# EAGLE design RotaryTable_RevB (EAGLE 7.6.0)

## Sheet 1 of 3
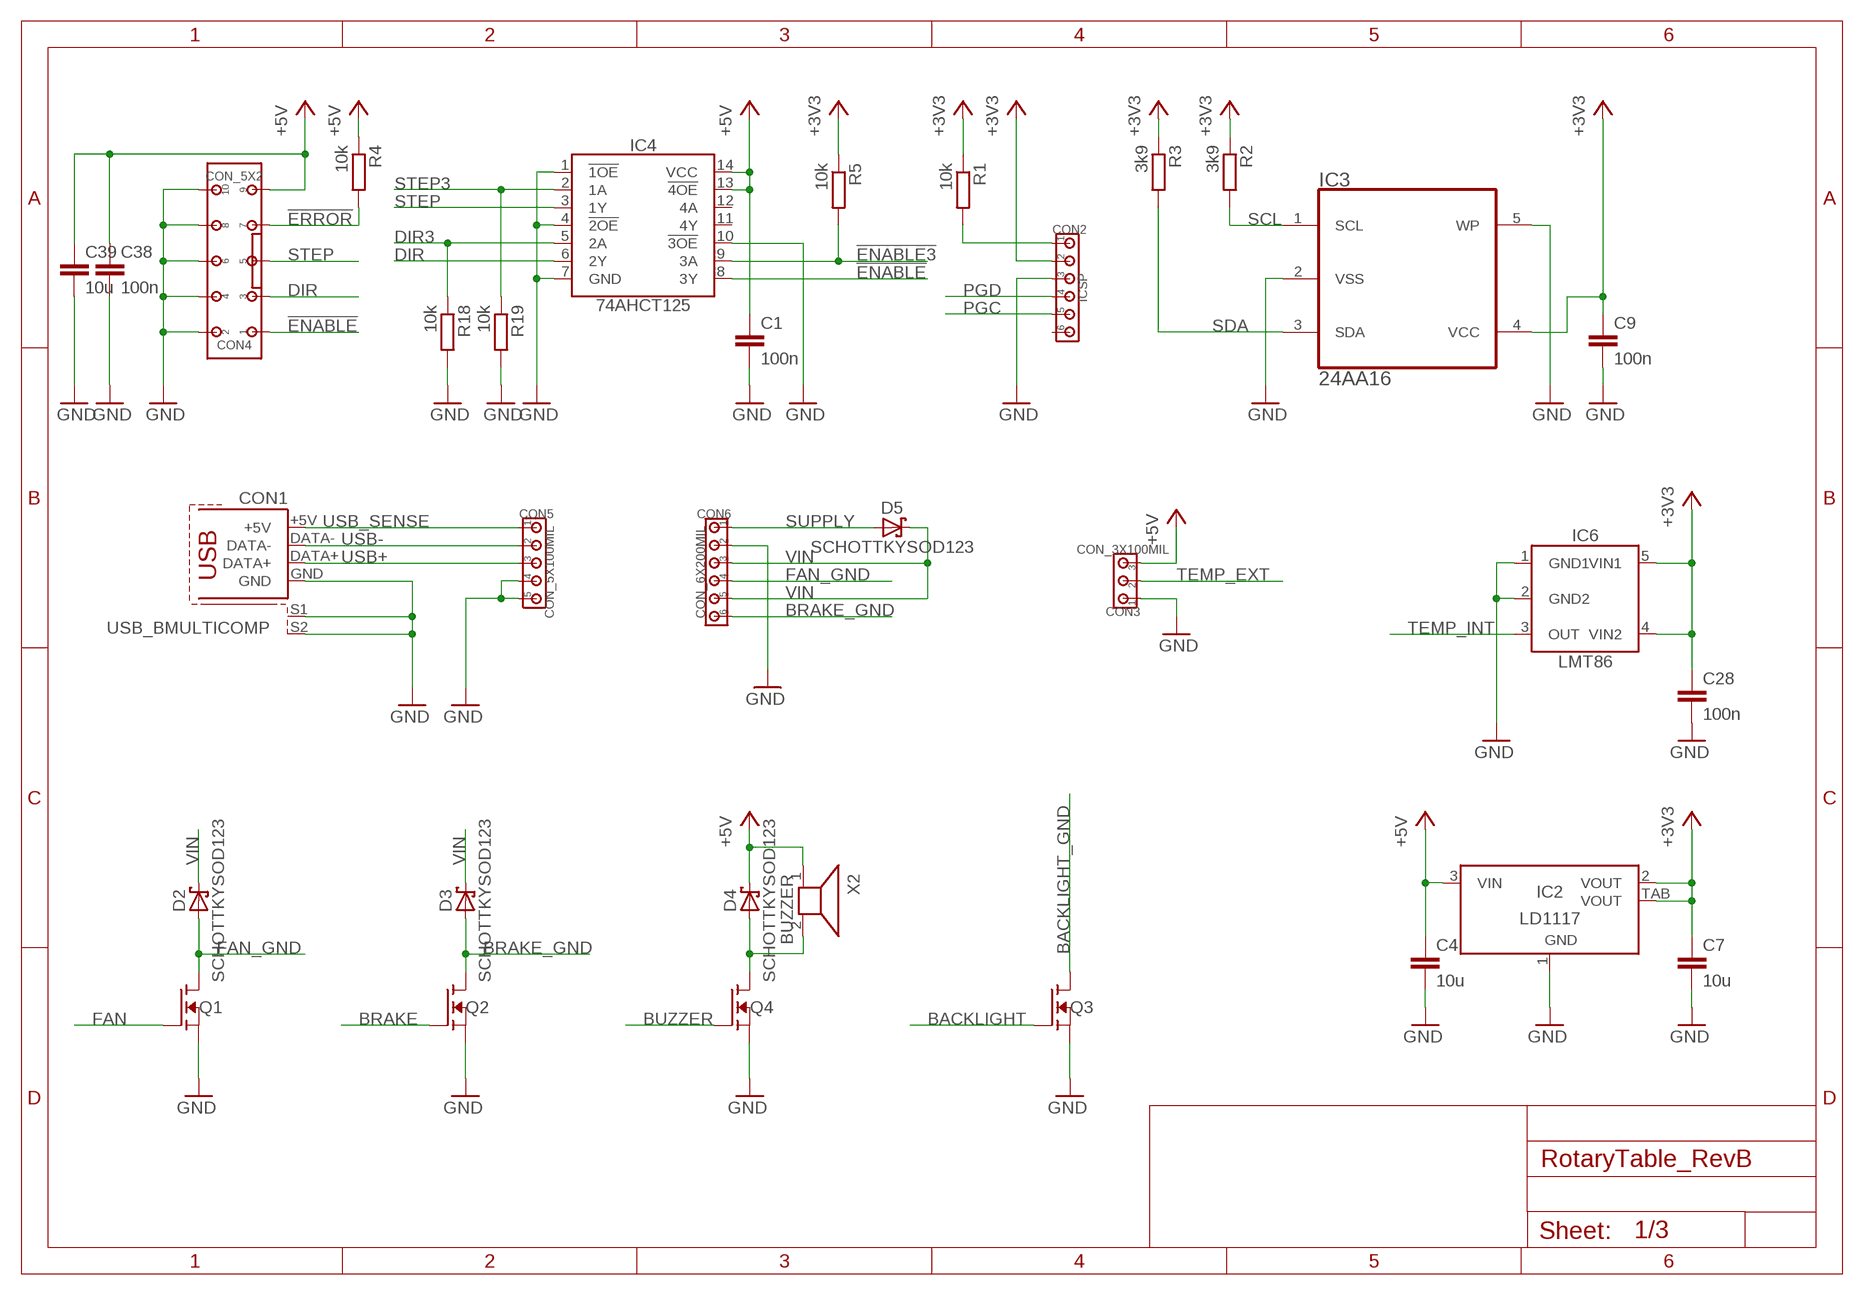
[diagram p0: schematic, sheet 1]

### Parts
C1  100n  CC0805  [C0805]
C4  10u  CC0805  [C0805]
C7  10u  CC0805  [C0805]
C9  100n  CC0805  [C0805]
C28  100n  CC0805  [C0805]
C38  100n  CC0805  [C0805]
C39  10u  CC0805  [C0805]
CON1  USB_BMULTICOMP  [USB_B]
CON2  ICSP  CON_6X100MIL  [100MIL_6X]
CON3  CON_3X100MIL  [100MIL_3X]
CON4  CON_5X2  [100MIL_5X2]
CON5  CON_5X100MIL  [100MIL_5X]
CON6  CON_6X200MIL  [200MIL_6X]
D2  SCHOTTKYSOD123  [SOD123]
D3  SCHOTTKYSOD123  [SOD123]
D4  SCHOTTKYSOD123  [SOD123]
D5  SCHOTTKYSOD123  [SOD123]
IC2  LD1117  [SOT223]
IC3  24AA16  [SOT-23-5]
IC4  74AHCT125  74HC125  [SO14]
IC6  LMT86  [SC70-5]
Q1  N-FETSOT23  [SOT23]
Q2  N-FETSOT23  [SOT23]
Q3  N-FETSOT23  [SOT23]
Q4  N-FETSOT23  [SOT23]
R1  10k  RESISTORR0805  [R0805]
R2  3k9  RESISTORR0805  [R0805]
R3  3k9  RESISTORR0805  [R0805]
R4  10k  RESISTORR0805  [R0805]
R5  10k  RESISTORR0805  [R0805]
R18  10k  RESISTORR0805  [R0805]
R19  10k  RESISTORR0805  [R0805]
X2  BUZZER  [BUZZER_14MM]

### Nets
!ENABLE3!: IC4.9(3A) R5.2 ; also sheet 3
!ENABLE!: CON4.1 IC4.8(3Y)
!ERROR!: CON4.7 R4.2 ; also sheet 3
!MCLR!: CON2.1 R1.2 ; also sheet 3
+3V3: C7.1 C9.1 C28.1 CON2.2 IC2.2(VOUT) IC2.TAB(VOUT) IC3.4(VCC) IC6.4(VIN2) IC6.5(VIN1) R1.1 R2.1 R3.1 R5.1 ; also sheet 2,3
+5V: C1.1 C4.1 C38.1 C39.1 CON3.3 CON4.9 D4.C IC2.3(VIN) IC4.13(!4OE!) IC4.14(VCC) R4.1 X2.1 ; also sheet 2
BACKLIGHT: Q3.1(G) ; also sheet 3
BACKLIGHT_GND: Q3.3(D) ; also sheet 2
BRAKE: Q2.1(G) ; also sheet 3
BRAKE_GND: CON6.6 D3.A Q2.3(D)
BUZZER: Q4.1(G) ; also sheet 3
BUZZER_GND: D4.A Q4.3(D) X2.2
DIR: CON4.3 IC4.6(2Y)
DIR3: IC4.5(2A) R18.1 ; also sheet 3
FAN: Q1.1(G) ; also sheet 3
FAN_GND: CON6.4 D2.A Q1.3(D)
GND: C1.2 C4.2 C7.2 C9.2 C28.2 C38.2 C39.2 CON1.GND CON1.S1 CON1.S2 CON2.3 CON3.1 CON4.2 CON4.4 CON4.6 CON4.8 CON4.10 CON5.4 CON5.5 CON6.2 IC2.1(GND) IC3.2(VSS) IC3.5(WP) IC4.1(!1OE!) IC4.4(!2OE!) IC4.7(GND) IC4.10(!3OE!) IC6.1(GND1) IC6.2(GND2) Q1.2(S) Q2.2(S) Q3.2(S) Q4.2(S) R18.2 R19.2 ; also sheet 2,3
PGC: CON2.5 ; also sheet 3
PGD: CON2.4 ; also sheet 3
SCL: IC3.1(SCL) R2.2 ; also sheet 2,3
SDA: IC3.3(SDA) R3.2 ; also sheet 2,3
STEP: CON4.5 IC4.3(1Y)
STEP3: IC4.2(1A) R19.1 ; also sheet 3
SUPPLY [24V]: CON6.1 D5.A
TEMP_EXT: CON3.2 ; also sheet 3
TEMP_INT: IC6.3(OUT) ; also sheet 3
USB+: CON1.DATA+ CON5.3 ; also sheet 3
USB-: CON1.DATA- CON5.2 ; also sheet 3
USB_SENSE: CON1.+5V CON5.1 ; also sheet 3
VIN [24V]: CON6.3 CON6.5 D2.C D3.C D5.C ; also sheet 2
Unconnected: CON2.6 IC4.11(4Y) IC4.12(4A)

## Sheet 2 of 3
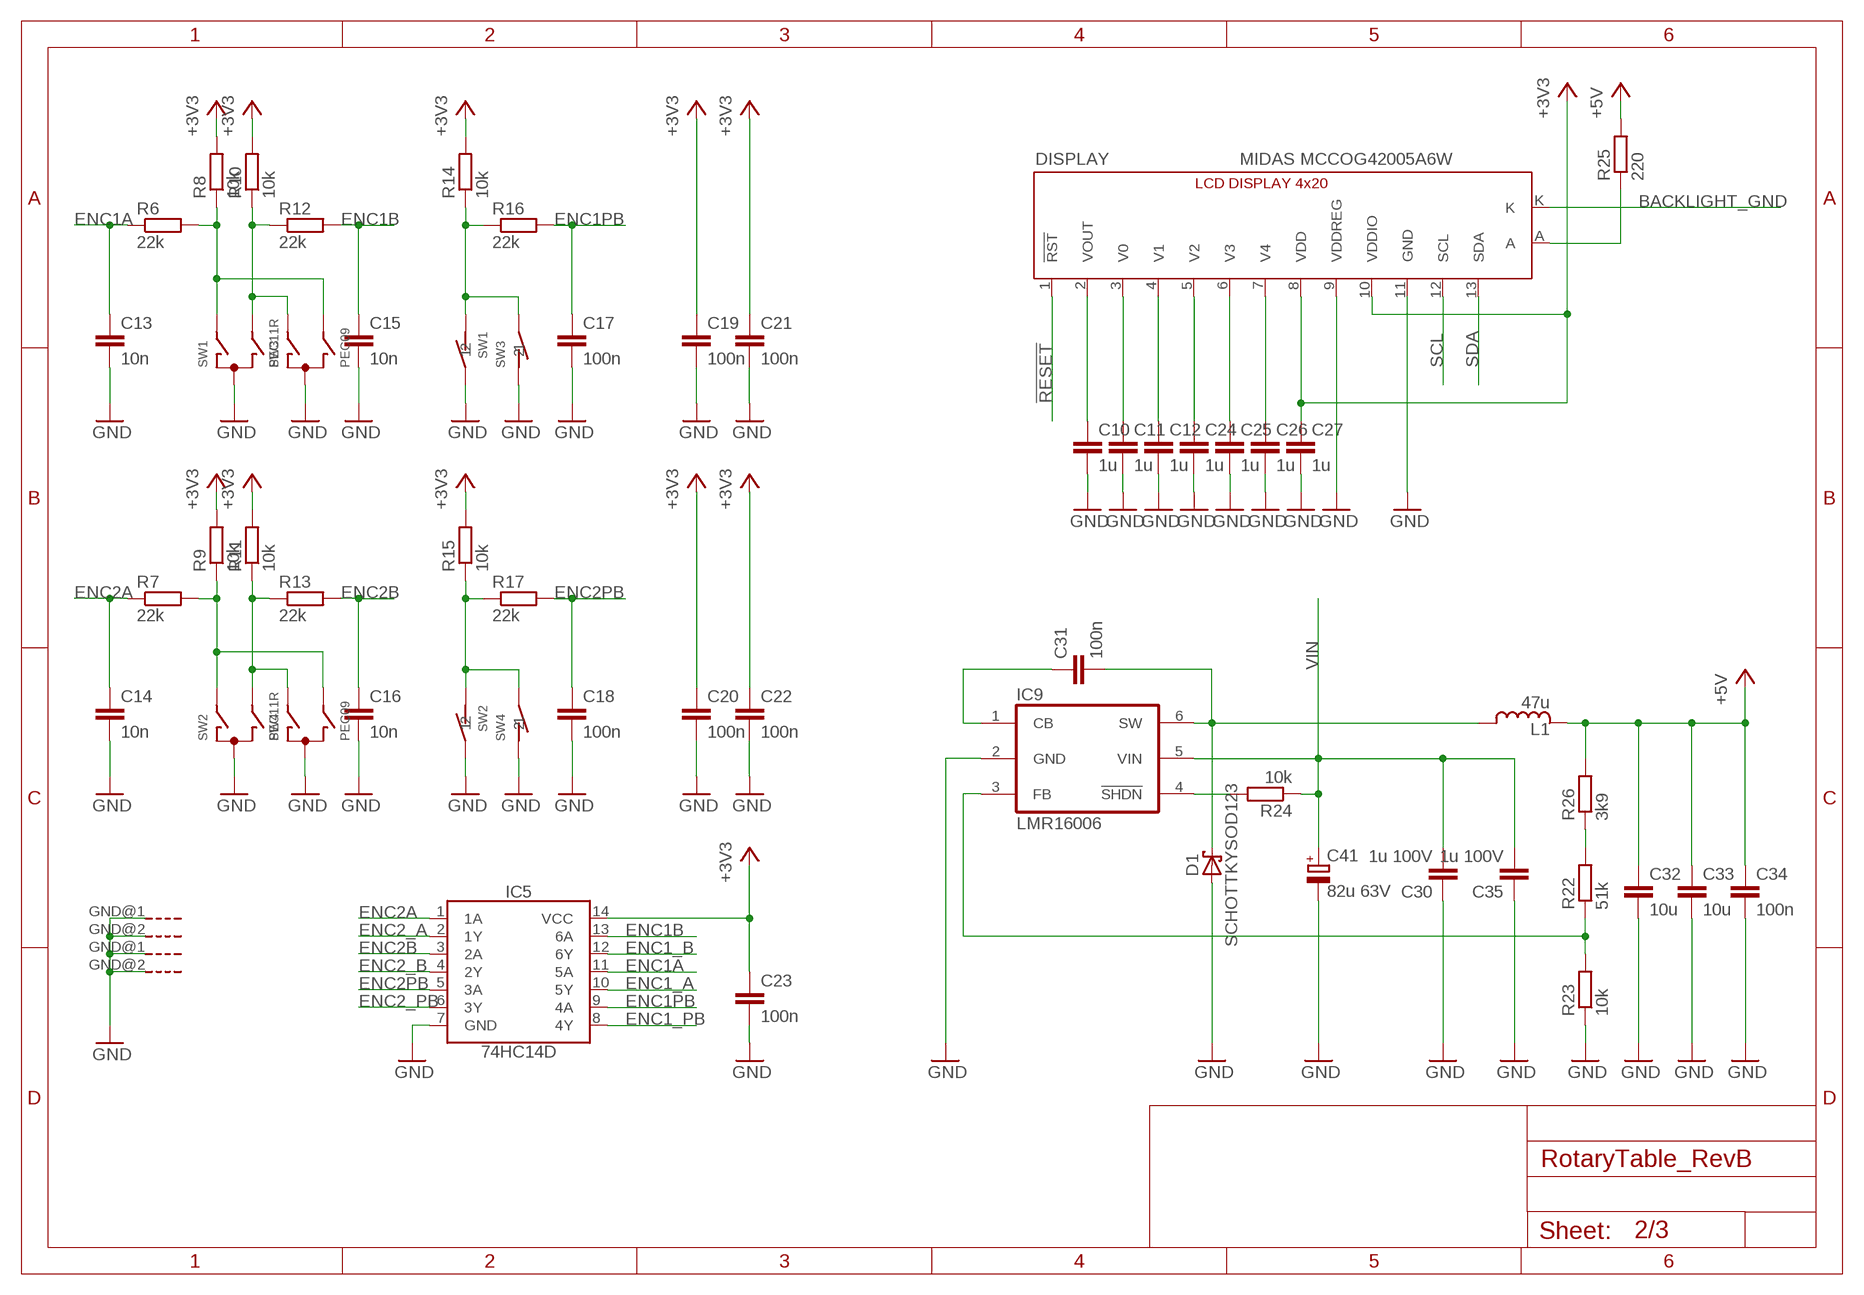
[diagram p1: schematic, sheet 2]

### Parts
C10  1u  CC0805  [C0805]
C11  1u  CC0805  [C0805]
C12  1u  CC0805  [C0805]
C13  10n  CC0805  [C0805]
C14  10n  CC0805  [C0805]
C15  10n  CC0805  [C0805]
C16  10n  CC0805  [C0805]
C17  100n  CC0805  [C0805]
C18  100n  CC0805  [C0805]
C19  100n  CC0805  [C0805]
C20  100n  CC0805  [C0805]
C21  100n  CC0805  [C0805]
C22  100n  CC0805  [C0805]
C23  100n  CC0805  [C0805]
C24  1u  CC0805  [C0805]
C25  1u  CC0805  [C0805]
C26  1u  CC0805  [C0805]
C27  1u  CC0805  [C0805]
C30  1u 100V  CC0805  [C0805]
C31  100n  CC0805  [C0805]
C32  10u  CC0805  [C0805]
C33  10u  CC0805  [C0805]
C34  100n  CC0805  [C0805]
C35  1u 100V  CC0805  [C0805]
C41  82u 63V  C_POLARIZED8MM  [8MM]
D1  SCHOTTKYSOD123  [SOD123]
DISPLAY  MIDAS MCCOG42005A6W  LCD4X20_I2C  [LCD_4X20_I2C]
IC5  74HC14D  [SO14]
IC9  LMR16006  [SOT-32-6]
L1  47u  INDUCTORSRN5040  [SRN5040]
R6  22k  RESISTORR0805  [R0805]
R7  22k  RESISTORR0805  [R0805]
R8  10k  RESISTORR0805  [R0805]
R9  10k  RESISTORR0805  [R0805]
R10  10k  RESISTORR0805  [R0805]
R11  10k  RESISTORR0805  [R0805]
R12  22k  RESISTORR0805  [R0805]
R13  22k  RESISTORR0805  [R0805]
R14  10k  RESISTORR0805  [R0805]
R15  10k  RESISTORR0805  [R0805]
R16  22k  RESISTORR0805  [R0805]
R17  22k  RESISTORR0805  [R0805]
R22  51k  RESISTORR0805  [R0805]
R23  10k  RESISTORR0805  [R0805]
R24  10k  RESISTORR0805  [R0805]
R25  220  RESISTORR0805  [R0805]
R26  3k9  RESISTORR0805  [R0805]
SW1  PEC11R  ENCODER_BOURNS  [ENCODER_BOURNS]
SW2  PEC11R  ENCODER_BOURNS  [ENCODER_BOURNS]
SW3  PEC09  [PEC09]
SW4  PEC09  [PEC09]

### Nets
!RESET!: DISPLAY.1(!RST!) ; also sheet 3
+3V3: C19.1 C20.1 C21.1 C22.1 C23.1 C27.1 DISPLAY.8(VDD) DISPLAY.10(VDDIO) IC5.14(VCC) R8.2 R9.2 R10.2 R11.2 R14.2 R15.2 ; also sheet 1,3
+5V: C32.1 C33.1 C34.1 L1.2 R25.2 R26.2 ; also sheet 1
BACKLIGHT_GND: DISPLAY.K ; also sheet 1
ENC1_A: IC5.10(5Y) ; also sheet 3
ENC1_B: IC5.12(6Y) ; also sheet 3
ENC1_PB: IC5.8(4Y) ; also sheet 3
ENC1A: C13.1 IC5.11(5A) R6.1
ENC1B: C15.1 IC5.13(6A) R12.2
ENC1PB: C17.1 IC5.9(4A) R16.2
ENC2_A: IC5.2(1Y) ; also sheet 3
ENC2_B: IC5.4(2Y) ; also sheet 3
ENC2_PB: IC5.6(3Y) ; also sheet 3
ENC2A: C14.1 IC5.1(1A) R7.1
ENC2B: C16.1 IC5.3(2A) R13.2
ENC2PB: C18.1 IC5.5(3A) R17.2
GND: C10.2 C11.2 C12.2 C13.2 C14.2 C15.2 C16.2 C17.2 C18.2 C19.2 C20.2 C21.2 C22.2 C23.2 C24.2 C25.2 C26.2 C27.2 C30.1 C32.2 C33.2 C34.2 C35.1 C41.- D1.A DISPLAY.9(VDDREG) DISPLAY.11(GND) IC5.7(GND) IC9.2(GND) R23.1 SW1.2 SW1.C SW1.GND@1(G) SW1.GND@2(G) SW2.2 SW2.C SW2.GND@1(G) SW2.GND@2(G) SW3.C SW3.D SW4.C SW4.D ; also sheet 1,3
N$2: IC9.4(!SHDN!) R24.2
N$6: C31.1 IC9.1(CB)
N$8: IC9.3(FB) R22.1 R23.2
N$11: R22.2 R26.1
N$12: R15.1 R17.1 SW2.1 SW4.E
N$13: R10.1 R12.1 SW1.B SW3.A
N$14: R6.2 R8.1 SW1.A SW3.B
N$15: DISPLAY.A R25.1
N$17: R7.2 R9.1 SW2.A SW4.B
N$19: R14.1 R16.1 SW1.1 SW3.E
N$20: R11.1 R13.1 SW2.B SW4.A
N$25: C10.1 DISPLAY.2(VOUT)
N$26: C11.1 DISPLAY.3(V0)
N$27: C26.1 DISPLAY.7(V4)
N$28: C25.1 DISPLAY.6(V3)
N$29: C24.1 DISPLAY.5(V2)
N$30: C12.1 DISPLAY.4(V1)
SCL: DISPLAY.12(SCL) ; also sheet 1,3
SDA: DISPLAY.13(SDA) ; also sheet 1,3
SWITCH: C31.2 D1.C IC9.6(SW) L1.1
VIN [24V]: C30.2 C35.2 C41.+ IC9.5(VIN) R24.1 ; also sheet 1

## Sheet 3 of 3
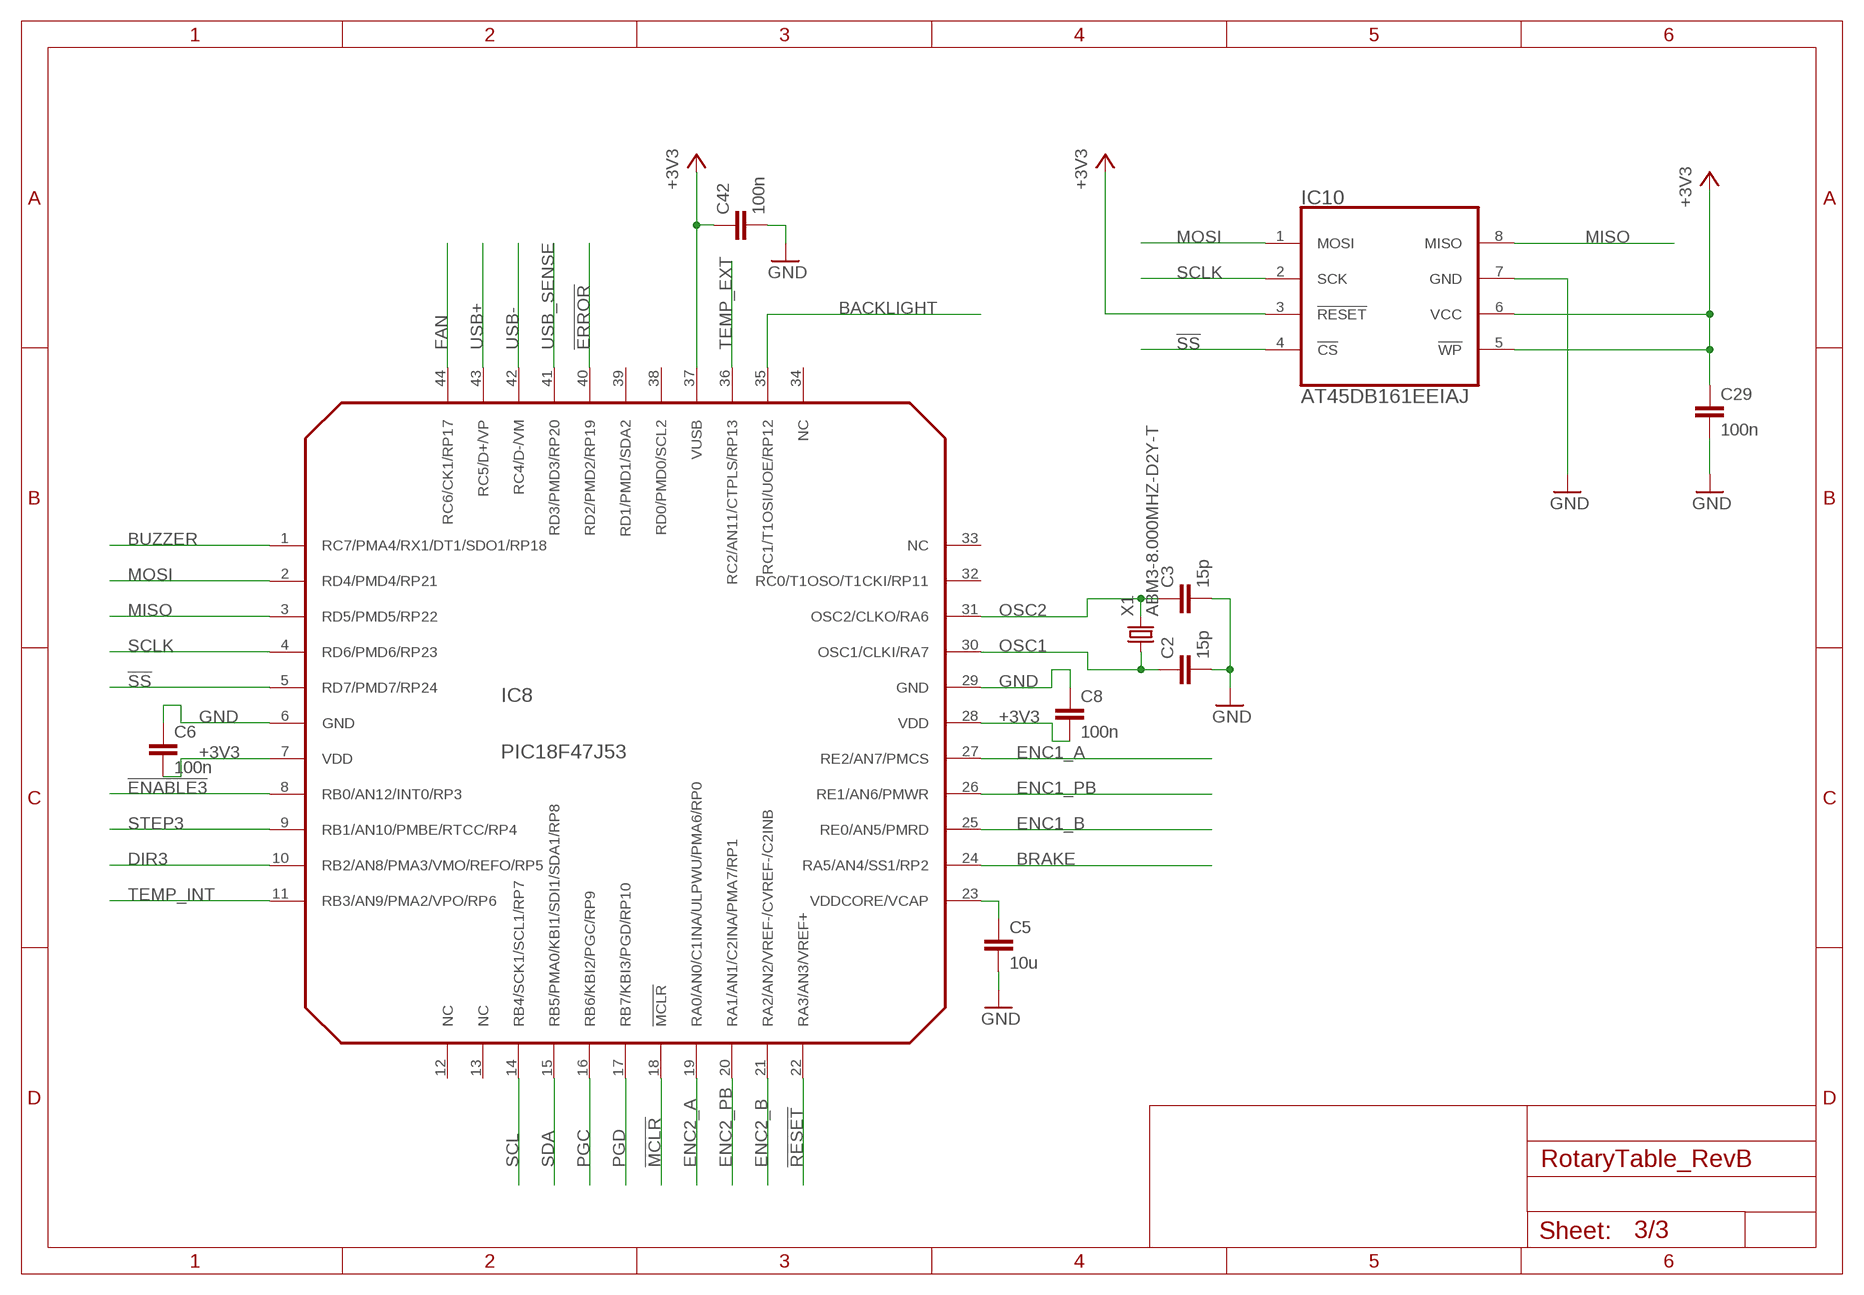
[diagram p2: schematic, sheet 3]

### Parts
C2  15p  CC0805  [C0805]
C3  15p  CC0805  [C0805]
C5  10u  CC0805  [C0805]
C6  100n  CC0805  [C0805]
C8  100n  CC0805  [C0805]
C29  100n  CC0805  [C0805]
C42  100n  CC0805  [C0805]
IC8  PIC18F47J53  PIC18F46J50  [TQFP44]
IC10  AT45DB161EEIAJ  [EIAJ_SOIC8]
X1  ABM3-8.000MHZ-D2Y-T  CRYSTAL5X3.2MM  [5X3.2MM]

### Nets
!ENABLE3!: IC8.8(RB0/AN12/INT0/RP3) ; also sheet 1
!ERROR!: IC8.40(RD2/PMD2/RP19) ; also sheet 1
!MCLR!: IC8.18(!MCLR!) ; also sheet 1
!RESET!: IC8.22(RA3/AN3/VREF+) ; also sheet 2
!SS!: IC8.5(RD7/PMD7/RP24) IC10.4(!CS!)
+3V3: C6.2 C8.2 C29.1 C42.1 IC8.7(VDD) IC8.28(VDD) IC8.37(VUSB) IC10.3(!RESET!) IC10.5(!WP!) IC10.6(VCC) ; also sheet 1,2
BACKLIGHT: IC8.35(RC1/T1OSI/UOE/RP12) ; also sheet 1
BRAKE: IC8.24(RA5/AN4/SS1/RP2) ; also sheet 1
BUZZER: IC8.1(RC7/PMA4/RX1/DT1/SDO1/RP18) ; also sheet 1
DIR3: IC8.10(RB2/AN8/PMA3/VMO/REFO/RP5) ; also sheet 1
ENC1_A: IC8.27(RE2/AN7/PMCS) ; also sheet 2
ENC1_B: IC8.25(RE0/AN5/PMRD) ; also sheet 2
ENC1_PB: IC8.26(RE1/AN6/PMWR) ; also sheet 2
ENC2_A: IC8.19(RA0/AN0/C1INA/ULPWU/PMA6/RP0) ; also sheet 2
ENC2_B: IC8.21(RA2/AN2/VREF-/CVREF-/C2INB) ; also sheet 2
ENC2_PB: IC8.20(RA1/AN1/C2INA/PMA7/RP1) ; also sheet 2
FAN: IC8.44(RC6/CK1/RP17) ; also sheet 1
GND: C2.2 C3.2 C5.2 C6.1 C8.1 C29.2 C42.2 IC8.6(GND) IC8.29(GND) IC10.7(GND) ; also sheet 1,2
MISO: IC8.3(RD5/PMD5/RP22) IC10.8(MISO)
MOSI: IC8.2(RD4/PMD4/RP21) IC10.1(MOSI)
N$16: C5.1 IC8.23(VDDCORE/VCAP)
OSC1: C2.1 IC8.30(OSC1/CLKI/RA7) X1.1
OSC2: C3.1 IC8.31(OSC2/CLKO/RA6) X1.2
PGC: IC8.16(RB6/KBI2/PGC/RP9) ; also sheet 1
PGD: IC8.17(RB7/KBI3/PGD/RP10) ; also sheet 1
SCL: IC8.14(RB4/SCK1/SCL1/RP7) ; also sheet 1,2
SCLK: IC8.4(RD6/PMD6/RP23) IC10.2(SCK)
SDA: IC8.15(RB5/PMA0/KBI1/SDI1/SDA1/RP8) ; also sheet 1,2
STEP3: IC8.9(RB1/AN10/PMBE/RTCC/RP4) ; also sheet 1
TEMP_EXT: IC8.36(RC2/AN11/CTPLS/RP13) ; also sheet 1
TEMP_INT: IC8.11(RB3/AN9/PMA2/VPO/RP6) ; also sheet 1
USB+: IC8.43(RC5/D+/VP) ; also sheet 1
USB-: IC8.42(RC4/D-/VM) ; also sheet 1
USB_SENSE: IC8.41(RD3/PMD3/RP20) ; also sheet 1
Unconnected: IC8.12(NC) IC8.13(NC) IC8.32(RC0/T1OSO/T1CKI/RP11) IC8.33(NC) IC8.34(NC) IC8.38(RD0/PMD0/SCL2) IC8.39(RD1/PMD1/SDA2)

## Library data of the parts
C1-C35 C38 C39 C42 = 00Capacitor:C: Capacitor
C41 = 00Capacitor:C_POLARIZED
CON1 = 00Connector:USB_B: Type B USB connector
CON2 CON6 = 00Connector:CON_6X: 6-pin header
CON3 = 00Connector:CON_3X: 3-pin header
CON4 = 00Connector:CON_5X2
CON5 = 00Connector:CON_5X: 5-pin header
D1-D5 = 00Diode:SCHOTTKY
DISPLAY = 00Display:LCD4X20_I2C: 4x20 character LCD display with I2C interface
IC2 = 00VoltageRegulator:LD1117: Positive Voltage Regulator 800mA
IC3 = 00Logic:24AA16: 16K I2C Serial EEPROM
IC4 = 00Logic:74HC125: Quad buffer/line driver; 3-state
IC5 = 00Logic:74HC14: Hex Inverter Schmitt Trigger
IC6 = 00Sensor:LMT86: Analog Temperature Sensors with Class-AB Output
IC8 = 00PIC:PIC18F46J50: Low-power 8bit microcontroller with USB
IC9 = 00VoltageRegulator:LMR16006: 60 V 0.6 A Buck Regulator
IC10 = 00Logic:AT45DB161E: 16-Mbit DataFlash
L1 = 00Inductor:INDUCTOR
Q1-Q4 = 00Mosfet:N-FET: N-Channel MOSFET
R1-R19 R22-R26 = 00Resistor:RESISTOR: RESISTOR, European symbol
SW1 SW2 = 00Switch:ENCODER_BOURNS: Bourns Rotary Encoder with Switch PEC11-4xxxF-Sxxxx
SW3 SW4 = 00Switch:PEC09
X1 = 00Crystal:CRYSTAL: Crystal
X2 = 00MyParts:BUZZER

## Net classes
1 24V: clearance 0.305 mm

## Board
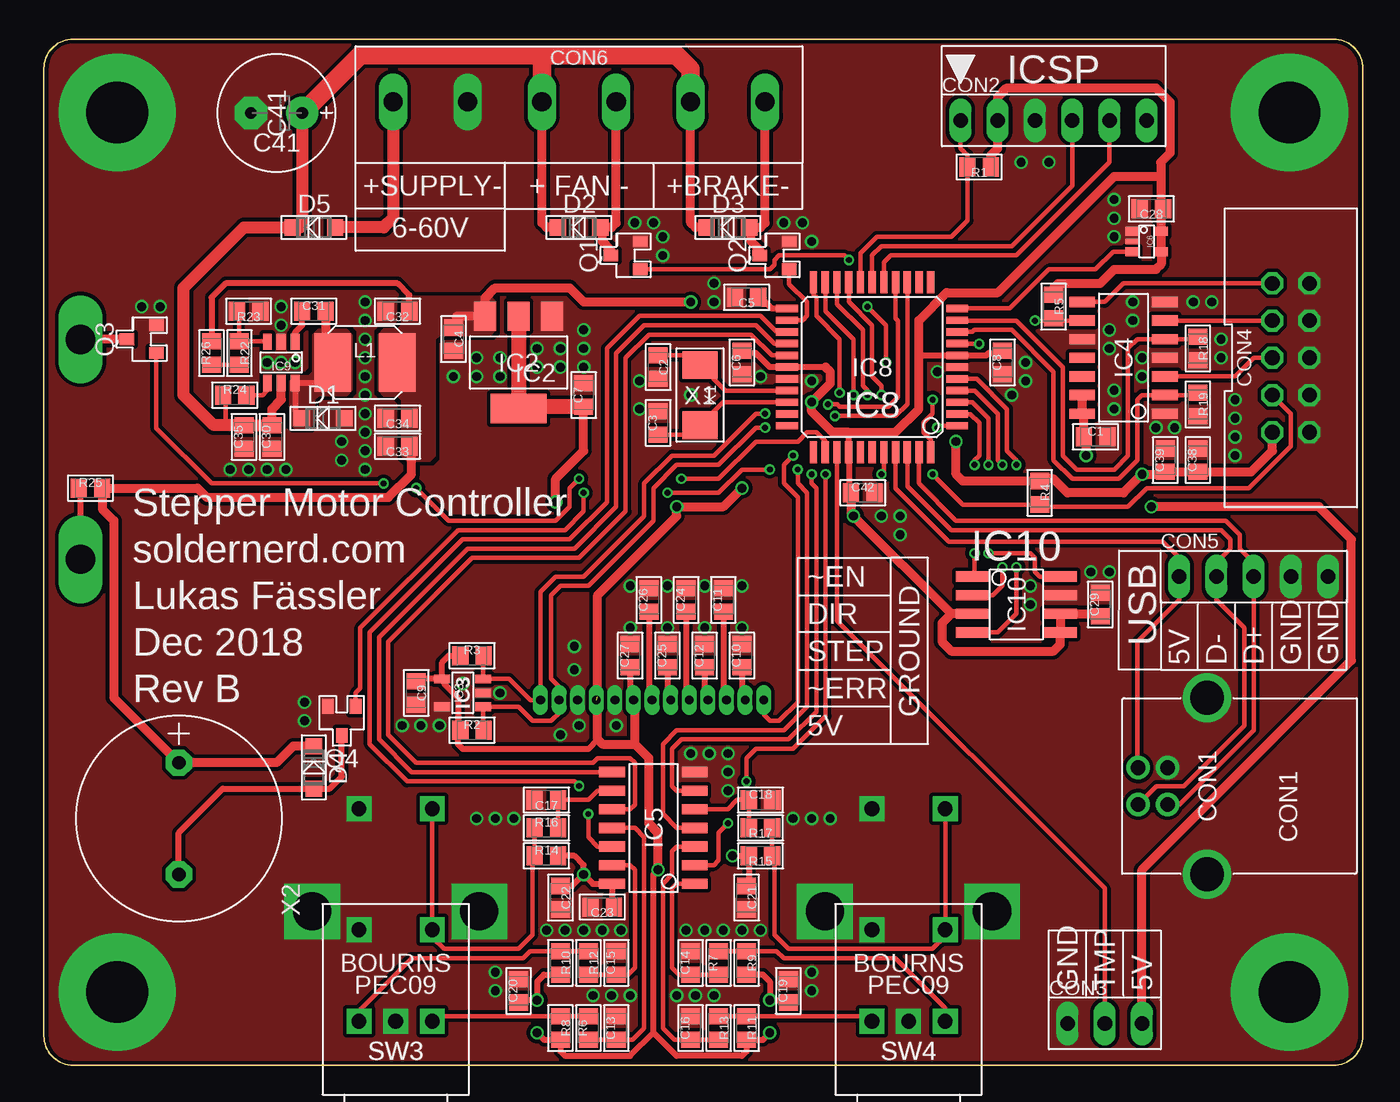
[diagram p3: board, top side]
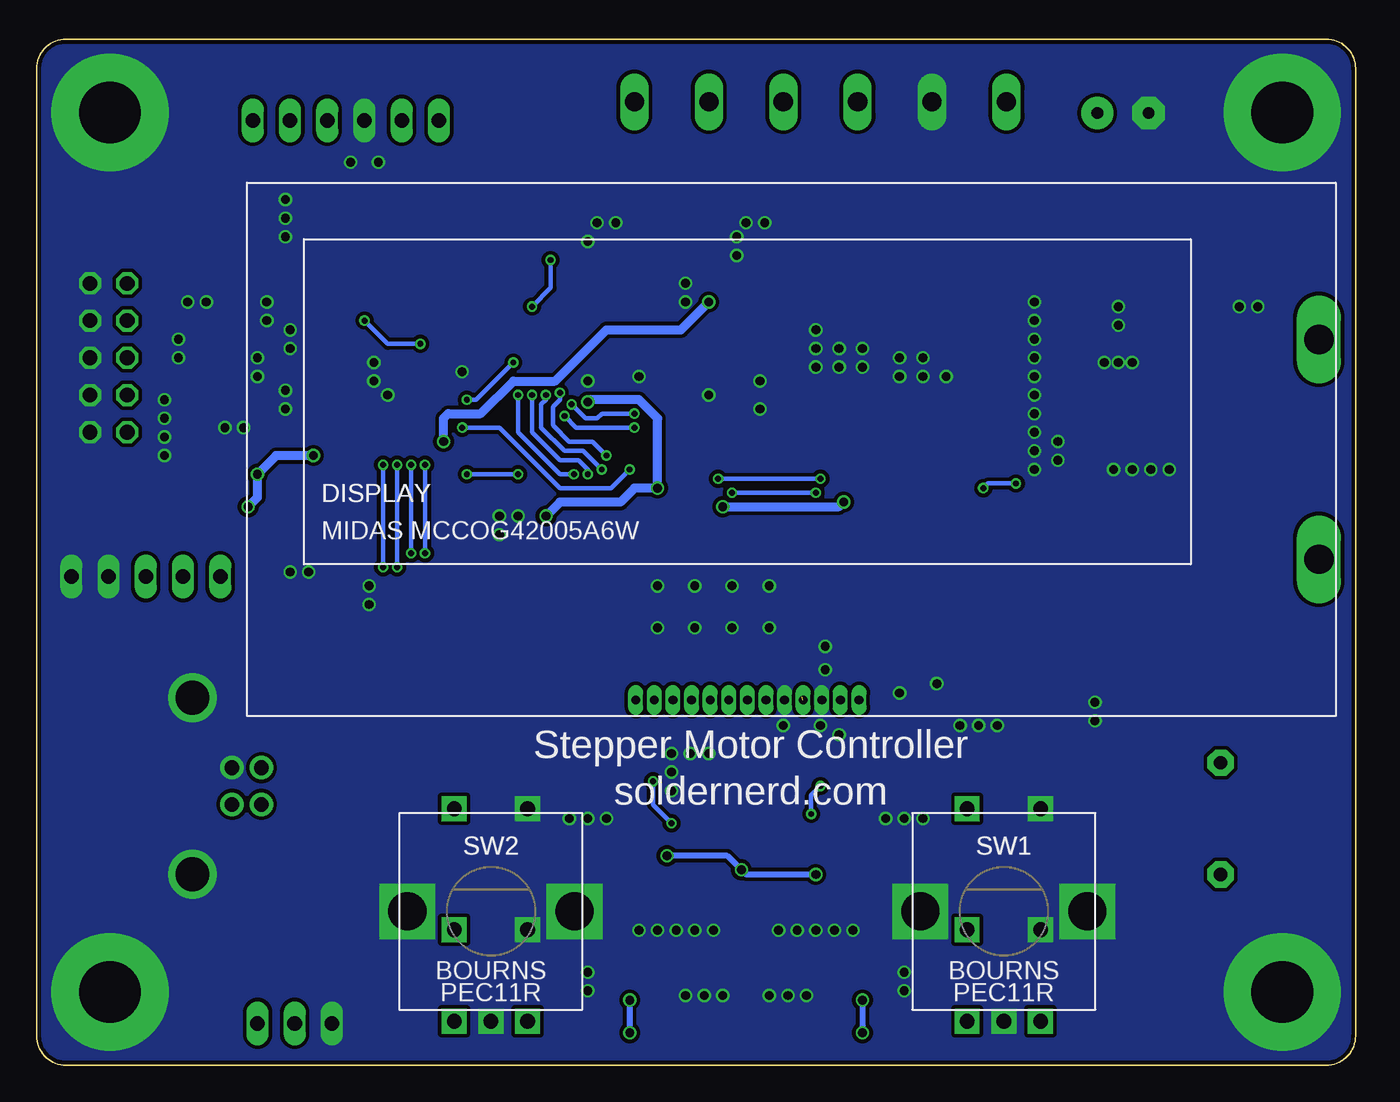
[diagram p4: board, bottom side, seen from below]

Size 90 x 70 mm. Coordinates in mm from the lower left corner, seen from the top.
Outline: 88,0 arc90 90,2 90,68 arc90 88,70 2,70 arc90 0,68 0,2 arc90 2,0 88,0
Copper layers (1*16): Top 0.035mm / dielectric 1.5mm / Bottom 0.035mm
Design rules "dirt_cheap_dirty_boards.6mil": minimum track width 6mil, minimum drill 12mil, track to track 6mil, track to pad 6mil, pad to pad 6mil, via to via 6mil, smd to smd 0mil, copper to edge 10mil, drill to drill 10mil, minimum pad ring 8mil, minimum via ring 6mil, stop-mask expansion 2mil, vias tented up to drill 25mil, thermal gap 10mil

### Footprints (pad centres in the part's own frame; a part is rotated, then mirrored left to right if it is on the bottom)
C0805 = smd 1.1 x 1.3: 1 -0.8,0; 2 0.8,0
8MM = drill 0.8 pad 2.2: + -1.75,0 | drill 0.8 pad 2.2 octagon: - 1.75,0
USB_B = drill 1 pad 1.6: +5V 1.25,4.71; DATA+ -1.25,2.71; DATA- -1.25,4.71; GND 1.25,2.71 | drill 2.3 pad 3: S1 -6.02,0; S2 6.02,0
100MIL_6X = drill 1 long: 1 -6.35,0; 2 -3.81,0; 3 -1.27,0; 4 1.27,0; 5 3.81,0; 6 6.35,0
100MIL_3X = drill 1 long: 1 -2.54,0; 2 0,0; 3 2.54,0
100MIL_5X2 = drill 1 octagon: 1 5.08,1.27; 2 5.08,-1.27; 3 2.54,1.27; 4 2.54,-1.27; 5 0,1.27; 6 0,-1.27; 7 -2.54,1.27; 8 -2.54,-1.27; 9 -5.08,1.27; 10 -5.08,-1.27
100MIL_5X = drill 1 long: 1 -5.08,0; 2 -2.54,0; 3 0,0; 4 2.54,0; 5 5.08,0
200MIL_6X = drill 1.3 long: 1 -12.7,0; 2 -7.62,0; 3 -2.54,0; 4 2.54,0; 5 7.62,0; 6 12.7,0
SOD123 = smd 1.1 x 1.1: A 1.45,0; C -1.45,0
LCD_4X20_I2C = drill 0.6 pad 0.9 long: 1 26.53,1.1; 2 27.8,1.1; 3 29.07,1.1; 4 30.34,1.1; 5 31.61,1.1; 6 32.88,1.1; 7 34.15,1.1; 8 35.42,1.1; 9 36.69,1.1; 10 37.96,1.1; 11 39.23,1.1; 12 40.5,1.1; 13 41.77,1.1 | drill 2 long: A 73.15,10.7; K 73.15,25.7
SOT223 = smd 1.5 x 2: 1 -2.3,-3.15; 2 0,-3.15; 3 2.3,-3.15 | smd 3.8 x 2: TAB 0,3.15
SOT-23-5 = smd 0.6 x 1.1: 1 -0.95,-1.4; 2 0,-1.4; 3 0.95,-1.4; 4 0.95,1.4; 5 -0.95,1.4
SO14 = smd 0.7 x 1.75: 1 -3.81,-2.825; 2 -2.54,-2.825; 3 -1.27,-2.825; 4 0,-2.825; 5 1.27,-2.825; 6 2.54,-2.825; 7 3.81,-2.825; 8 3.81,2.825; 9 2.54,2.825; 10 1.27,2.825; 11 0,2.825; 12 -1.27,2.825; 13 -2.54,2.825; 14 -3.81,2.825
SC70-5 = smd 0.6 x 0.9: 1 -0.7,-1; 3 0.7,-1; 4 0.7,1; 5 -0.7,1 | smd 0.4 x 0.9: 2 0,-1
TQFP44 = smd 1.5 x 0.5: 1 -5.8,4; 2 -5.8,3.2; 3 -5.8,2.4; 4 -5.8,1.6; 5 -5.8,0.8; 6 -5.8,0; 7 -5.8,-0.8; 8 -5.8,-1.6; 9 -5.8,-2.4; 10 -5.8,-3.2; 11 -5.8,-4; 23 5.8,-4; 24 5.8,-3.2; 25 5.8,-2.4; 26 5.8,-1.6; 27 5.8,-0.8; 28 5.8,0; 29 5.8,0.8; 30 5.8,1.6; 31 5.8,2.4; 32 5.8,3.2; 33 5.8,4 | smd 0.5 x 1.5: 12 -4,-5.8; 13 -3.2,-5.8; 14 -2.4,-5.8; 15 -1.6,-5.8; 16 -0.8,-5.8; 17 0,-5.8; 18 0.8,-5.8; 19 1.6,-5.8; 20 2.4,-5.8; 21 3.2,-5.8; 22 4,-5.8; 34 4,5.8; 35 3.2,5.8; 36 2.4,5.8; 37 1.6,5.8; 38 0.8,5.8; 39 0,5.8; 40 -0.8,5.8; 41 -1.6,5.8; 42 -2.4,5.8; 43 -3.2,5.8; 44 -4,5.8
SOT-32-6 = smd 0.6 x 1.1: 1 -0.95,-1.4; 2 0,-1.4; 3 0.95,-1.4; 4 0.95,1.4; 5 0,1.4; 6 -0.95,1.4
EIAJ_SOIC8 = smd 2.25 x 0.7: 1 -3,1.905; 2 -3,0.635; 3 -3,-0.635; 4 -3,-1.905; 5 3,-1.905; 6 3,-0.635; 7 3,0.635; 8 3,1.905
SRN5040 = smd 2.5 x 4: 1 -2.2,0; 2 2.2,0
SOT23 = smd 0.8 x 1: 1 -0.95,-1; 2 0.95,-1; 3 0,1
R0805 = smd 1.1 x 1.3: 1 -0.8,0; 2 0.8,0
ENCODER_BOURNS = drill 1 pad 1.7 square: 1 -2.5,7; 2 2.5,7; A -2.5,-7.5; B 2.5,-7.5; C 0,-7.5 | drill 2.6 pad 3.8 square: GND@1 -5.7,0; GND@2 5.7,0
PEC09 = drill 1 pad 1.7 square: A -2.5,0; B 2.5,0; C 0,0; D -2.5,6.25; E 2.5,6.25
5X3.2MM = smd 1.9 x 2.4: 1 -2.05,0; 2 2.05,0
BUZZER_14MM = drill 0.9 pad 1.8 octagon: 1 -3.81,0; 2 3.81,0

### Placement (x,y rotation side)
C1  71.75,42.86 0 top
C2  41.91,47.62 270 top
C3  41.91,43.81 90 top
C4  27.94,49.53 270 top
C5  47.94,52.39 180 top
C6  47.62,47.94 90 top
C7  36.83,45.72 90 top
C8  65.41,47.94 90 top
C9  25.4,25.4 270 top
C10  47.62,27.94 90 top
C11  46.35,31.75 90 top
C12  45.09,27.94 90 top
C13  39.05,2.54 90 top
C14  44.13,6.99 90 top
C15  39.05,6.99 90 top
C16  44.13,2.54 90 top
C17  34.29,18.1 180 top
C18  48.9,18.1 0 top
C19  50.8,5.08 90 top
C20  32.38,5.08 90 top
C21  47.94,11.43 270 top
C22  35.24,11.43 270 top
C23  38.1,10.79 180 top
C24  43.81,31.75 90 top
C25  42.55,27.94 90 top
C26  41.27,31.75 90 top
C27  40.01,27.94 90 top
C28  75.56,58.42 180 top
C29  72.07,31.43 90 top
C30  15.56,42.86 90 top
C31  18.41,51.44 0 top
C32  24.13,51.44 180 top
C33  24.13,42.23 180 top
C34  24.13,44.13 180 top
C35  13.65,42.86 90 top
C38  78.74,41.27 90 top
C39  76.52,41.27 90 top
C41  15.88,64.95 180 top
C42  55.88,39.05 0 top
CON1  79.38,19.05 90 top
CON2  68.9,64.45 0 top
CON3  72.39,2.86 0 top
CON4  85.09,48.26 90 top
CON5  82.55,33.34 0 top
CON6  36.51,65.72 0 top
D1  19.05,44.13 0 top
D2  36.51,57.15 0 top
D3  46.67,57.15 0 top
D4  18.41,20.32 270 top
D5  18.41,57.15 0 top
DISPLAY  75.65,23.81 0 bottom
IC2  32.38,47.94 180 top
IC3  28.57,25.4 90 top
IC4  73.66,48.26 90 top
IC5  41.59,16.19 90 top
IC6  75.25,56.2 270 top
IC8  56.52,47.62 180 top
IC9  16.19,47.94 180 top
IC10  66.36,31.43 0 top
L1  21.91,47.94 0 top
Q1  39.69,55.24 90 top
Q2  49.85,55.24 90 top
Q3  6.67,49.53 90 top
Q4  20.32,23.5 180 top
R1  63.82,61.28 180 top
R2  29.21,22.86 0 top
R3  29.21,27.94 0 top
R4  67.94,39.05 270 top
R5  68.9,51.75 270 top
R6  37.15,2.54 90 top
R7  46.04,6.99 90 top
R8  35.24,2.54 270 top
R9  47.94,6.99 270 top
R10  35.24,6.99 270 top
R11  47.94,2.54 270 top
R12  37.15,6.99 270 top
R13  46.04,2.54 270 top
R14  34.29,14.29 0 top
R15  48.9,14.29 180 top
R16  34.29,16.19 0 top
R17  48.9,16.19 180 top
R18  78.74,48.9 270 top
R19  78.74,45.09 270 top
R22  13.34,48.58 270 top
R23  13.97,51.44 180 top
R24  13.02,45.72 0 top
R25  3.17,39.37 0 top
R26  11.43,48.58 90 top
SW1  24,10.5 0 bottom
SW2  59,10.5 0 bottom
SW3  24,3 0 top
SW4  59,3 0 top
X1  44.77,45.72 270 top
X2  9.21,16.83 270 top

### Tracks (layer width: path | path; a pad name or v marks a point on that pad's centre or on a via)
!ENABLE3!  (via drill 0.4)
  Top 0.305: IC4.9 68.75,50.8 | IC8.8 62.24,49.23 62.23,49.21 v63.82,49.21 | v67.63,50.8 68.75,50.8 | 68.75,50.8 R5.2
  Bottom 0.305: v63.82,49.21 66.04,49.21 v67.63,50.8
!ENABLE!
  Top 0.305: CON4.1 73.66,53.34 72.39,52.07 IC4.8
!ERROR!  (via drill 0.4)
  Top 0.305: CON4.7 85.09,44.45 85.09,42.23 82.23,39.37 75.25,39.37 73.98,38.1 68.1,38.1 R4.2 62.71,38.25 v60.64,40.32 | IC8.40 57.31,40.49 v57.15,40.32
  Bottom 0.305: v57.15,40.32 v60.64,40.32
!MCLR!
  Top 0.305: CON2.1 62.55,62.55 63.02,62.08 R1.2 63.02,57.62 61.91,56.52 56.83,56.52 55.72,55.4 IC8.18
!RESET!  (via drill 0.4)
  Top 0.305: DISPLAY.1 49.12,23.91 49.53,23.5 50.16,23.5 51.44,24.77 51.44,38.73 50.48,39.69 50.48,40.96 v51.12,41.59 | v54.29,45.88 54.29,49.53 52.7,51.12 52.7,52.39 52.52,52.58 IC8.22
  Bottom 0.305: v54.29,45.88 54.29,45.4 54.77,44.93 54.77,43.66 53.66,42.55 52.07,42.55 v51.12,41.59
!SS!  (via drill 0.4)
  Top 0.305: IC8.5 63.66,46.83 65.72,44.77 65.72,41.91 66.36,41.27 v66.36,40.96 | IC10.4 65.09,29.53 66.36,30.8 v66.36,33.97
  Bottom 0.305: v66.36,33.97 v66.36,40.96
+3V3  (via drill 0.6)  (1 unrouted)
  Top 0.305: 38.68,12.38 IC5.14
  Top 0.406: v49.53,2.22 49.05,1.74 R11.2 47.94,0.95 47.62,0.64 43.18,0.64 41.59,2.22 | v33.66,2.22 34.14,1.74 R8.2 35.24,0.95 35.56,0.64 40.01,0.64 41.59,2.22 | C20.1 32.55,4.45 v33.66,4.45 33.66,5.71 34.12,6.18 R10.2 | 35.09,12.38 C22.1 36.04,12.23 v36.83,13.02 | 41.59,2.22 41.59,13.02 v41.91,13.34 | v36.83,13.02 37.47,12.38 IC5.14 38.77,10.93 C23.1 | v36.83,13.02 36.83,13.65 36.2,14.29 R14.2 | v46.99,14.29 R15.2 48.09,12.38 C21.1 | R9.2 49.06,6.18 49.53,5.71 v49.53,4.45 50.63,4.45 C19.1 | 28.26,27.79 R3.1 27.62,27.94 27.18,27.49 IC3.4 | IC3.4 25.55,26.35 C9.1 | IC3.4 27.3,26.22 27.3,26.04 28.26,25.08 28.26,23.01 R2.1 28.26,22.71 28.26,21.91 28.57,21.59 37.15,21.59 37.78,22.23 | C27.1 40.01,25.14 DISPLAY.8 | 76.25,58.3 C28.1 | C6.2 47.79,48.58 48.58,48.58 49.53,47.62 IC8.28 53.34,47.62 | C42.1 54.91,39.22 IC8.37 54.91,43.18 | 59.69,48.26 59.85,48.42 IC8.7 64.3,48.42 64.45,48.58 65.24,48.58 | 71.91,30.8 C29.1
  Top 0.61: v41.91,13.34 41.91,15.88 41.27,16.51 41.27,20.95 40.32,21.91 | 37.78,25.14 37.78,32.07 43.18,37.47 v43.18,38.1 46.35,38.1 v47.62,39.37 | IC2.TAB 32.41,44.77 | 32.38,44.92 IC2.TAB | 33.66,44.79 IC2.TAB | R1.1 64.62,62.08 65.09,62.55 CON2.2 65.09,66.04 65.72,66.67 75.88,66.67 76.83,65.72 76.83,62.23 76.2,61.59 76.2,60.64 | 76.25,58.3 IC6.5 IC6.4 76.25,54.66 75.88,54.29 73.03,54.29 72.07,53.34 69.22,53.34 68.9,53.02 R5.1 | 40.32,21.91 38.1,21.91 37.78,22.23 37.78,24.82 DISPLAY.10 | 40.32,21.91 40.32,24.82 DISPLAY.8 | 76.2,60.64 76.2,58.59 C28.1 | 53.34,47.62 53.66,47.31 53.66,46.51 v52.39,45.24 52.39,44.61 53.82,43.18 54.91,43.18 58.1,43.18 59.69,44.77 59.69,48.26 59.69,50.8 61.59,52.7 65.09,52.7 73.03,60.64 76.2,60.64 | 71.91,30.8 IC10.6 IC10.5 69.36,28.72 68.9,28.26 61.91,28.26 61.28,28.89 61.28,30.16 61.91,30.8 | IC10.3 61.91,30.8 | C42.1 55.08,37.63 v55.24,37.47 61.91,30.8 | v34.92,38.42 34.92,40.01 36.83,41.91 C7.1 | 65.24,48.58 C8.2
  Top 1.016: IC2.2 IC2.TAB | C7.1 32.38,44.92
  Bottom 0.406: v49.53,4.45 v49.53,2.22 | v33.66,4.45 v33.66,2.22 | v36.83,13.02 41.59,13.02 v41.91,13.34 42.86,14.29 v46.99,14.29
  Bottom 0.61: v43.18,38.1 35.24,38.1 v34.92,38.42 | v52.39,45.24 52.23,45.4 48.9,45.4 47.62,44.13 v47.62,39.37 49.21,39.37 50.16,38.42 54.29,38.42 v55.24,37.47
+5V  (via drill 0.6)
  Top 0.305: 70.95,44.45 IC4.14
  Top 0.406: 70.95,44.33 IC4.14 | C32.1 24.93,52.54 24.13,53.34 12.38,53.34 11.43,52.39 R26.2 11.28,49.53 | 25.08,42.08 C33.1
  Top 0.61: IC4.13 IC4.14 | 70.95,44.45 C1.1 71.12,42.7 v71.12,41.59 | CON4.9 83.82,41.91 82.39,40.48 C38.1 C39.1 76.36,40.32 v74.93,40.32 73.66,39.05 69.85,39.05 68.9,40.01 68.1,40.01 R4.1 62.7,39.85 62.23,40.32 v62.23,42.55 | 28.13,51.09 IC2.3 30.09,52.31 30.8,53.02 35.88,53.02 36.83,52.07 v44.13,52.07 | 23.98,48.07 L1.2 23.98,47.81 | D4.C 17.01,21.77 15.88,20.64 X2.1 4.76,25.08 4.76,37.15 3.98,37.94 R25.2 10.48,39.37 11.11,38.73 23.5,38.73 25.08,40.32 25.08,42.08 | CON3.3 74.93,13.34 89.22,27.62 89.22,35.88 87,38.1 v75.56,38.1
  Bottom 0.61: v71.12,41.59 73.66,41.59 v74.93,40.32 74.93,38.73 v75.56,38.1 | v62.23,42.55 62.23,44.13 61.91,44.45 59.69,44.45 57.47,46.67 54.61,46.67 51.12,50.16 46.04,50.16 v44.13,52.07
  pour Top (no thermals): 22.86,46.04 23.18,45.72 24.13,45.72 24.45,45.4 24.45,41.59 24.77,41.27 26.35,41.27 26.67,41.59 26.67,49.53 26.99,49.85 30.48,49.85 30.8,50.16 30.8,52.07 30.48,52.39 24.77,52.39 24.45,52.07 24.45,50.48 24.13,50.16 23.18,50.16 22.86,49.85
BACKLIGHT  (via drill 0.4)
  Top 0.305: IC8.35 53.31,42.57 52.7,43.18 52.07,43.18 51.44,42.55 48.58,42.55 46.04,40.01 v43.5,40.01 | v36.51,40.01 35.88,39.37 35.88,38.1 34.92,37.15 27.62,37.15 v25.4,39.37 | v23.18,39.69 11.43,39.69 7.67,43.45 Q3.1
  Bottom 0.305: v43.5,40.01 v36.51,40.01 | v25.4,39.37 25.08,39.69 v23.18,39.69
BACKLIGHT_GND
  Top 0.61: Q3.3 2.52,49.53 DISPLAY.K
BRAKE
  Top 0.305: IC8.24 51.78,50.83 52.07,51.12 52.07,52.07 50.85,53.29 Q2.1
BRAKE_GND
  Top 0.61: Q2.3 48.85,55.61 48.26,56.2 48.26,57.01 D3.A 48.9,57.15 49.21,57.47 CON6.6
BUZZER  (via drill 0.4)
  Top 0.305: Q4.1 21.27,25.4 21.59,25.72 21.59,29.84 28.26,36.51 35.56,36.51 36.83,37.78 v36.83,39.05 | v42.55,39.05 46.04,39.05 47.62,40.64 v49.53,40.64 | IC8.1 61.09,43.62 v60.96,43.5
  Bottom 0.305: v36.83,39.05 v42.55,39.05 | v60.96,43.5 58.42,43.5 54.29,39.37 50.8,39.37 v49.53,40.64
BUZZER_GND
  Top 0.406: X2.2 9.21,15.88 12.2,18.87 D4.A 19.5,18.87 20.32,19.68 Q4.3
DIR
  Top 0.305: IC4.6 CON4.3
DIR3
  Top 0.305: R18.1 78.58,49.53 IC4.5 74.61,49.53 73.98,48.9 73.98,41.59 73.03,40.64 70.48,40.64 69.53,41.59 69.53,47.62 66.36,50.8 62.34,50.8 IC8.10
ENC1_A
  Top 0.305: IC5.10 40.01,17.46 40.32,17.78 40.32,20.64 40.01,20.95 37.78,20.95 37.47,20.64 25.4,20.64 23.5,22.54 23.5,28.89 29.21,34.61 36.51,34.61 39.69,37.78 39.69,48.26 41.27,49.85 48.26,49.85 49.68,48.42 IC8.27
ENC1_B  (via drill 0.4)
  Top 0.305: IC5.12 37.78,14.92 37.15,15.56 v37.15,17.14 | v36.51,19.05 36.2,19.37 24.77,19.37 22.23,21.91 22.23,29.53 28.57,35.88 35.88,35.88 38.42,38.42 38.42,48.9 40.64,51.12 48.9,51.12 49.99,50.02 IC8.25
  Bottom 0.305: v37.15,17.14 37.15,18.41 v36.51,19.05
ENC1_PB
  Top 0.305: IC5.8 25.08,20 22.86,22.23 22.86,29.21 28.89,35.24 36.2,35.24 39.05,38.1 39.05,48.58 40.96,50.48 48.58,50.48 49.84,49.23 IC8.26
ENC1A
  Top 0.305: R6.1 C13.1 40.16,1.74 40.96,2.54 40.96,15.56 40.32,16.19 IC5.11
ENC1B
  Top 0.305: R12.2 C15.1 39.84,6.18 40.32,6.67 40.32,13.34 40.01,13.65 IC5.13
ENC1PB
  Top 0.305: R16.2 C17.1 37.15,18.1 37.78,18.73 IC5.9
ENC2_A  (via drill 0.4)
  Top 0.305: IC5.2 45.72,13.65 46.04,13.97 46.04,15.88 v46.67,16.51 | v47.94,19.37 47.94,20.95 48.58,21.59 51.12,21.59 53.34,23.81 v53.34,40.32 | IC8.19 54.91,52.08 56.52,50.48 56.52,46.99 57.15,46.35 v57.15,45.72
  Bottom 0.305: v46.67,16.51 47.94,17.78 v47.94,19.37 | v57.15,45.72 57.15,43.18 54.29,40.32 v53.34,40.32
ENC2_B  (via drill 0.4)
  Top 0.305: IC5.4 43.18,16.19 42.23,17.14 42.23,21.91 43.18,22.86 50.48,22.86 52.07,24.45 52.07,39.05 51.44,39.69 v51.44,40.64 | v55.24,45.72 55.24,49.53 53.34,51.44 53.34,53.4 IC8.21
  Bottom 0.305: v55.24,45.72 55.24,45.4 55.56,45.09 55.56,43.5 53.98,41.91 52.7,41.91 v51.44,40.64
ENC2_PB  (via drill 0.4)
  Top 0.305: IC5.6 43.18,18.73 42.86,19.05 42.86,21.59 43.5,22.23 50.8,22.23 52.7,24.13 52.7,39.37 52.39,39.69 v52.39,40.32 | IC8.20 54.12,51.93 55.88,50.16 55.88,46.35 56.2,46.04 v56.2,45.72
  Bottom 0.305: v52.39,40.32 52.39,40.64 53.02,41.27 54.29,41.27 56.2,43.18 v56.2,45.72
ENC2A
  Top 0.305: R7.1 C14.1 43.34,6.18 42.86,6.67 42.86,12.06 43.18,12.38 IC5.1
ENC2B
  Top 0.305: R13.2 C16.1 43.03,1.74 42.23,2.54 42.23,12.38 42.86,13.02 42.86,14.61 43.18,14.92 IC5.3
ENC2PB
  Top 0.305: R17.2 C18.1 47.31,18.1 46.67,17.46 IC5.5
FAN  (via drill 0.4)
  Top 0.305: IC8.44 60.52,42.67 60.01,43.18 60.01,43.81 60.64,44.45 v60.64,45.4 | Q1.1 49.53,54.3 49.85,54.61 49.85,54.93 50.16,55.24 54.61,55.24 v54.93,54.93 | v57.47,47.94 57.47,50.48 v56.2,51.75
  Bottom 0.305: v56.2,51.75 54.93,53.02 v54.93,54.93 | v60.64,45.4 60.01,45.4 v57.47,47.94
FAN_GND
  Top 0.61: Q1.3 38.69,55.61 38.1,56.2 38.1,57.01 D2.A 38.73,57.15 39.05,57.47 CON6.4
GND  (via drill 0.6, 4.2 pad 8)
  other vias: 5,5 85,5 5,65 85,65 38.1,9.21 39.37,9.21 40.01,4.76 43.81,9.21 45.09,9.21 43.18,4.76 38.73,4.76 44.45,4.76 32.07,16.83 30.8,16.83 53.66,16.83 52.39,16.83 34.29,9.21 35.56,9.21 46.67,18.73 52.39,5.08 46.67,20 51.12,16.83 46.35,9.21 36.83,9.21 29.53,16.83 45.72,4.76 37.47,4.76 36.51,23.18 39.05,23.18 52.39,6.35 46.67,21.27 30.8,6.35 30.8,5.08 44.13,21.27 45.4,21.27 48.9,9.21 47.62,9.21 40.64,46.67 40.64,44.77 44.13,45.72 45.09,29.84 42.55,29.84 40.01,32.7 40.01,29.84 42.55,32.7 45.09,32.7 47.62,32.7 47.62,29.84 28.57,26.04 31.11,25.4 21.91,52.07 21.91,50.8 17.78,24.77 21.91,46.99 21.91,48.26 21.91,41.91 17.78,23.5 20.32,41.27 21.91,43.18 6.67,51.75 16.19,47.94 7.94,51.75 20.32,42.55 21.91,49.53 21.91,45.72 21.91,44.45 36.83,50.16 27.94,46.99 29.53,48.26 33.66,48.9 35.24,48.9 36.83,48.9 33.66,47.62 35.24,47.62 36.83,47.62 31.11,46.99 31.11,48.26 29.53,46.99 24.45,23.18 25.72,23.18 26.99,23.18 36.2,28.57 36.2,26.99 35.24,22.54 51.75,57.47 81.28,41.59 77.15,43.5 75.88,43.5 73.03,44.77 73.03,46.04 81.28,42.86 81.28,44.13 81.28,45.4 80.33,48.26 80.33,49.53 79.69,52.07 78.42,52.07 74.3,52.07 74.3,50.8 74.93,48.26 74.93,46.99 72.71,48.9 72.71,50.16 66.67,61.59 68.58,61.59 42.23,56.52 50.48,57.47 41.59,57.47 42.23,55.24 52.39,56.2 17.14,47.94 15.24,47.94 21.91,40.64 16.19,51.75 16.19,50.48 40.32,57.47 12.7,40.64 13.97,40.64 15.24,40.64 16.51,40.64 73.03,59.05 73.03,57.78 73.03,56.52 45.72,53.34 45.72,52.07 66.99,47.94 66.99,46.67 66.04,45.72 67.31,32.7 67.31,31.43 71.44,33.66 72.71,33.66 48.9,46.99 52.39,46.67 57.15,37.47 58.42,37.47 58.42,36.2 60.96,47.31
  pour Bottom (isolate 0.254, rank 3, no thermals): 88,0 2,0 arc-90 0,2 0,68 arc-90 2,70 88,70 arc-90 90,68 90,2 arc-90
  pour Top (isolate 0.254, rank 3, no thermals): 0,2 0,68 arc-90 2,70 88,70 arc-90 90,68 90,2 arc-90 88,0 2,0 arc-90
MISO  (via drill 0.4)
  Top 0.305: IC8.3 63.36,45.23 64.45,44.13 v64.45,40.96 | IC10.8 67.94,33.34 67.63,33.66 67.63,34.61 67.31,34.92 v64.45,34.92
  Bottom 0.305: v64.45,34.92 v64.45,40.96
MOSI  (via drill 0.4)
  Top 0.305: IC8.2 63.21,44.42 63.82,43.81 63.82,41.59 63.5,41.27 v63.5,40.96 | IC10.1 63.5,33.48 v63.5,34.92
  Bottom 0.305: v63.5,40.96 v63.5,34.92
N$2
  Top 0.305: R24.2 14.92,45.72 15.24,46.04 IC9.4
N$6
  Top 0.406: IC9.1 17.14,50 17.62,50.48 C31.1
N$8
  Top 0.305: IC9.3 15.21,49.38 R22.1 13.34,51.44 R23.2
N$11
  Top 0.305: R22.2 R26.1
N$12
  Top 0.305: SW2.1 SW4.E 61.5,8.79 60.64,7.94 50.8,7.94 49.85,8.89 49.85,14.13 R15.1 R17.1
N$13
  Top 0.305: R12.1 R10.1 33.19,7.79 32.7,7.3 25.08,7.3 21.5,3.72 SW3.A
N$14
  Top 0.305: R6.2 R8.1 | 35.24,3.32 R8.1 | R8.1 26.84,3.34 SW3.B
N$15
  Top 0.406: DISPLAY.A 2.5,39.24 R25.1
N$16
  Top 0.406: C5.1 48.9,52.39 49.66,51.62 IC8.23
N$17
  Top 0.305: R7.2 R9.1 50,7.79 50.48,7.3 58.1,7.3 61.5,3.9 SW2.A
N$19
  Top 0.305: SW1.1 SW3.E 26.5,8.74 27.3,7.94 32.38,7.94 33.34,8.89 33.34,14.13 R14.1 R16.1
N$20
  Top 0.305: R13.1 R11.1 | 47.94,3.32 R11.1 | R11.1 56.16,3.34 SW2.B
N$25
  Top 0.406: C10.1 47.62,25.14 DISPLAY.2
N$26
  Top 0.406: C11.1 46.35,25.14 DISPLAY.3
N$27
  Top 0.406: C26.1 41.27,25.14 DISPLAY.7
N$28
  Top 0.406: C25.1 42.55,25.14 DISPLAY.6
N$29
  Top 0.406: C24.1 43.81,25.14 DISPLAY.5
N$30
  Top 0.406: C12.1 45.09,25.14 DISPLAY.4
OSC1
  Top 0.305: IC8.30 46.51,46.02 X1.1 44.11,48.42 C2.1
OSC2
  Top 0.305: IC8.31 46.32,45.23 X1.2 44.11,43.02 C3.1
PGC
  Top 0.305: CON2.5 72.71,61.59 66.36,55.24 57.78,55.24 57.31,54.77 IC8.16
PGD
  Top 0.305: CON2.4 70.17,60.01 66.04,55.88 57.15,55.88 56.52,55.24 IC8.17
SCL  (via drill 0.4)
  Top 0.305: R2.2 29.98,22.89 IC3.1 32.38,24.45 33.34,23.5 34.61,23.5 35.24,24.13 35.24,24.82 DISPLAY.12 35.24,25 35.24,25.72 34.61,26.35 34.61,32.07 35.24,32.7 37.15,32.7 41.59,37.15 41.59,39.37 43.18,40.96 46.04,40.96 48.58,43.5 v49.21,43.5 | IC8.14 58.91,45.1 58.1,44.29 v53.98,44.29
  Bottom 0.305: v49.21,43.5 53.18,43.5 v53.98,44.29
SCLK  (via drill 0.4)
  Top 0.305: IC8.4 63.51,46.02 65.09,44.45 65.09,41.27 v65.41,40.96 | IC10.2 64.77,32.07 65.41,32.7 v65.41,33.97
  Bottom 0.305: v65.41,33.97 v65.41,40.96
SDA  (via drill 0.4)
  Top 0.305: R3.2 29.98,27.91 IC3.3 31.75,26.35 33.19,24.91 DISPLAY.13 33.88,32.29 34.92,33.34 36.83,33.34 40.96,37.47 40.96,39.69 42.86,41.59 45.72,41.59 48.58,44.45 v49.21,44.45 | IC8.15 58.12,50.95 58.27,50.79 58.27,45.57 57.63,44.93 54.29,44.93 54.13,45.09 v53.5,45.09
  Bottom 0.305: v49.21,44.45 51.44,44.45 51.75,44.13 52.55,44.13 v53.5,45.09
STEP
  Top 0.305: IC4.3 81.28,46.99 82.55,48.26 CON4.5
STEP3
  Top 0.305: R19.1 78.58,45.72 IC4.2 74.93,45.72 74.61,45.4 74.61,41.27 73.34,40.01 70.17,40.01 68.9,41.27 68.9,47.31 66.04,50.16 63.5,50.16 63.36,50.02 IC8.9
SUPPLY
  Top 0.813: CON6.1 23.81,57.78 23.18,57.15 D5.A
SWITCH
  Top 0.406: 18.9,48.75 19.06,48.59 L1.1 19.68,47.92 19.68,46.99 19.24,46.54 IC9.6 17.14,44.63
  Top 0.61: C31.2 19.21,48.74 19.06,48.59
  pour Top (no thermals): 16.83,46.67 17.14,46.99 18.1,46.99 18.41,47.31 18.41,49.85 18.73,50.16 20.64,50.16 20.95,49.85 20.95,46.04 20.64,45.72 18.73,45.72 18.41,45.4 18.41,43.81 18.1,43.5 17.14,43.5 16.83,43.81
TEMP_EXT
  Top 0.305: IC8.36 54.12,30.34 72.39,12.06 CON3.2
TEMP_INT
  Top 0.305: IC6.3 72.96,55.5 71.75,54.29 68.58,54.29 65.91,51.62 IC8.11
USB+
  Top 0.305: CON1.DATA+ 76.69,17.78 77.47,17.78 82.55,22.86 CON5.3 82.55,34.29 81.6,35.24 81.6,36.2 80.64,37.15 62.23,37.15 59.69,39.69 59.69,41.8 IC8.43
USB-
  Top 0.305: CON1.DATA- 75.92,19.05 77.79,19.05 81.92,23.18 81.92,29.84 80.01,31.75 CON5.2 80.01,34.29 80.96,35.24 80.96,35.88 80.33,36.51 61.91,36.51 58.91,39.51 IC8.42
USB_SENSE
  Top 0.305: CON1.+5V 74.61,20.35 74.61,28.89 77.47,31.75 CON5.1 77.47,34.61 76.36,35.72 61.75,35.72 58.1,39.37 58.1,41.81 IC8.41
VIN
  Top 0.305: R24.1 12.38,45.55 12.38,43.66
  Top 0.61: C30.2 15.56,44.77 16.19,45.4 IC9.5 | D2.C 34.29,57.15 33.97,57.47 CON6.3 | D3.C 44.45,57.15 44.13,57.47 CON6.5
  Top 0.813: C30.2 C35.2 12.38,43.66 11.58,43.66 9.53,45.72 9.53,53.02 13.65,57.15 D5.C 17.46,57.15 17.62,57.31 C41.+
  Top 1.27: 33.97,68.9 43.18,68.9 44.13,67.94 CON6.5 | 33.97,68.9 21.57,68.9 C41.+ | CON6.3 33.97,68.9

### Text on the board
tPlace: ICSP | +SUPPLY- | + FAN - | +BRAKE- | 6-60V | Stepper Motor Controller | soldernerd.com | ~EN | Lukas Fässler | DIR | USB | Dec 2018 | STEP | GROUND | 5V | D- | D+ | GND | GND | Rev B | ~ERR | 5V | GND | TMP | 5V
bPlace: Stepper Motor Controller | soldernerd.com